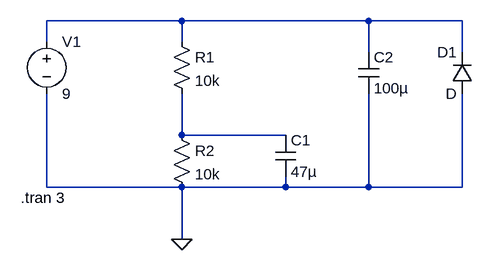
[diagram p0: schematic power_supply_pedal.asc]
power_supply_pedal.asc, the LTspice schematic file:
Version 4.1
SHEET 1 880 680
WIRE 272 64 64 64
WIRE 560 64 272 64
WIRE 704 64 560 64
WIRE 64 96 64 64
WIRE 272 96 272 64
WIRE 560 112 560 64
WIRE 704 112 704 64
WIRE 272 240 272 176
WIRE 432 240 272 240
WIRE 64 320 64 176
WIRE 272 320 64 320
WIRE 432 320 432 304
WIRE 432 320 272 320
WIRE 560 320 560 176
WIRE 560 320 432 320
WIRE 704 320 704 176
WIRE 704 320 560 320
WIRE 272 400 272 320
FLAG 272 400 0
SYMBOL voltage 64 80 R0
WINDOW 123 0 0 Left 0
WINDOW 39 0 0 Left 0
SYMATTR InstName V1
SYMATTR Value 9
SYMBOL res 256 80 R0
SYMATTR InstName R1
SYMATTR Value 10k
SYMBOL res 256 224 R0
SYMATTR InstName R2
SYMATTR Value 10k
SYMBOL cap 416 240 R0
SYMATTR InstName C1
SYMATTR Value 47µ
SYMBOL cap 544 112 R0
SYMATTR InstName C2
SYMATTR Value 100µ
SYMBOL diode 720 176 R180
WINDOW 0 24 64 Left 2
WINDOW 3 24 0 Left 2
SYMATTR InstName D1
TEXT 24 336 Left 2 !.tran 3

The netlist it stands for:
* power_supply_pedal.asc
V1 N001 0 9
R1 N001 N002 10k
R2 N002 0 10k
C1 N002 0 47µ
C2 N001 0 100µ
D1 0 N001 D
.model D D
.lib standard.dio
.tran 3
.backanno
.end